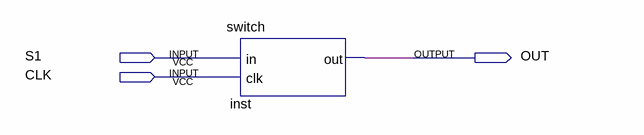
[diagram p0: schematic sheet]
// Quartus schematic test.bdf as structural Verilog: 1 symbols, 3 pins
module test (
  input  S1,
  input  CLK,
  output OUT
);

  switch inst (.in(S1), .clk(CLK), .out(OUT));
endmodule
